# Altium project 23-LoadCell.PrjPcb
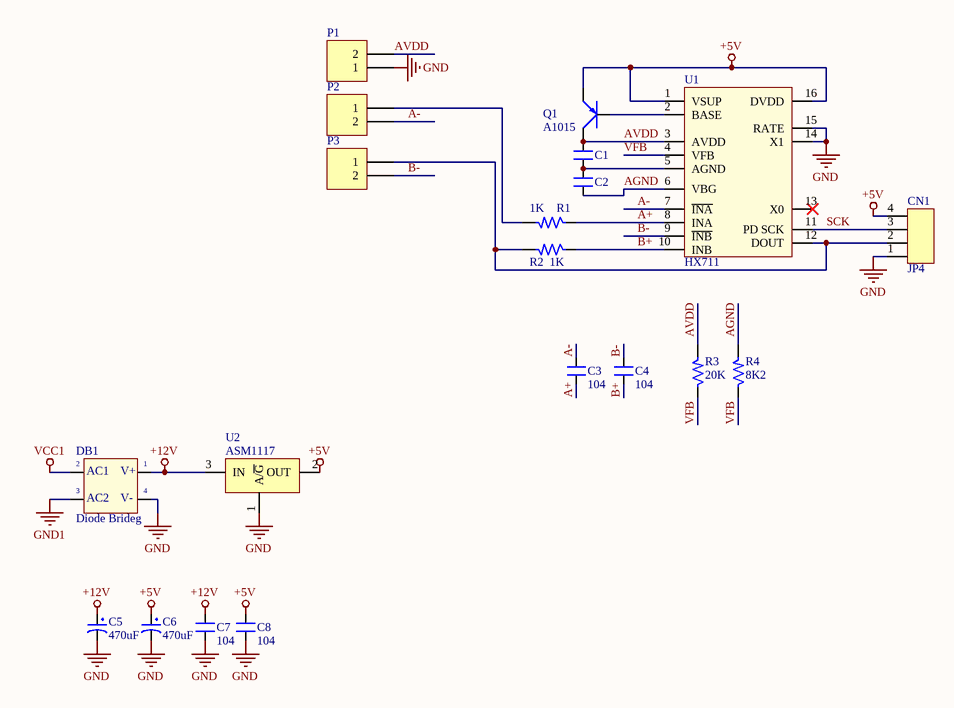
[diagram p0: 23-LoadCell.SchDoc]
1 sheet, 20 parts. Net scope: global (net labels, ports and power ports of the same name join across sheets).
Board file: 23-LoadCell.PcbDoc

## Sheet 23-LoadCell.SchDoc
size A4

### Parts
C1  106  [C-0805]  (value not drawn)
C2  106  [C-0805]  (value not drawn)
C3  104  [C-0805]
C4  104  [C-0805]
C5  470uF  [C-ALU-D6.5]
C6  470uF  [C-ALU-D6.5]
C7  104  [C-0805]
C8  104  [C-0805]
CN1  JP4  [JP4]
DB1  Diode Brideg  [D-DB-1A-SMD]
P1  KF301-2P  [TER-KF301-2]  (value not drawn)
P2  KF301-2P  [TER-KF301-2]  (value not drawn)
P3  KF301-2P  [TER-KF301-2]  (value not drawn)
Q1  A1015  [SOT-23-3]
R1  1K  [R-0805]
R2  1K  [R-0805]
R3  20K  [R-0805]
R4  8K2  [R-0805]
U1  HX711  [SOP-16L]
U2  ASM1117  [TO-252]

### Nets
+5V: C6.1 C8.2 CN1.4 Q1.1(E) U1.1(VSUP) U1.16(DVDD) U2.2(OUT)
+12V: C5.1 C7.2 DB1.3(AC2) U2.3(IN)
GND: C5.2 C6.2 C7.1 C8.1 CN1.1 DB1.4(-V_OUT) P1.1 U1.14(X1) U1.15(RATE) U2.1(A/~{G})
GND1: DB1.1(+V_OUT)
VCC1: DB1.2(AC1)
A+: C3.1 R1.1 U1.8(INA)
A-: C3.2 P2.2 U1.7(~{INA})
AGND: C2.1 R4.2 U1.6(VBG)
AVDD: C1.2 P1.2 Q1.2(C) R3.2 U1.3(AVDD)
B+: C4.1 R2.1 U1.10(INB)
B-: C4.2 P3.2 U1.9(~{INB})
SCK: CN1.3 U1.11(PD_SCK)
VFB: R3.1 R4.1 U1.4(VFB)
NetC1_1: C1.1 C2.2 U1.5(AGND)
NetCN1_2: CN1.2 P3.1 R2.2 U1.12(DOUT)
NetP2_1: P2.1 R1.2
NetQ1_3: Q1.3(B) U1.2(BASE)

Not connected (* = marked no-connect by the designer): U1 13(X0)*

### Notes on the sheet
- (in symbol DB) V+; V-

### Library data of the parts
C1-C4 C7 C8 = CN: Value: 0,1uF/300V; Designed by: VanDungEvn
C5 C6 = CP1: Cap P  0,1uF < 22uF , 16 - 50V; Value: 10uF/50V; Description 1: 10 => 220uF/6,3V/10V - 10uF => 100uF/16V; Description 2: 0,1uF => 33uF/50V - 10uF => 22uF/63V; Description 3: 0,47uF => 10uF/100V
DB1 = DB: Convert AC to DC voltage, 4 pin; Value: Cau 1A
P1-P3 = Header 2: Header, 2-Pin; LatestRevisionDate: 17-Jul-2002; LatestRevisionNote: Re-released for DXP Platform.; Publisher: Altium Limited
Q1 = A1015: PNP 600mW, ECB; Value: A1015
R1-R4 = R: Resistor 1/4W; Value: R1/4W - 1K
U1 = HX711: Value: HX711